# EAGLE design PicTouchTest (EAGLE 7.7.0)
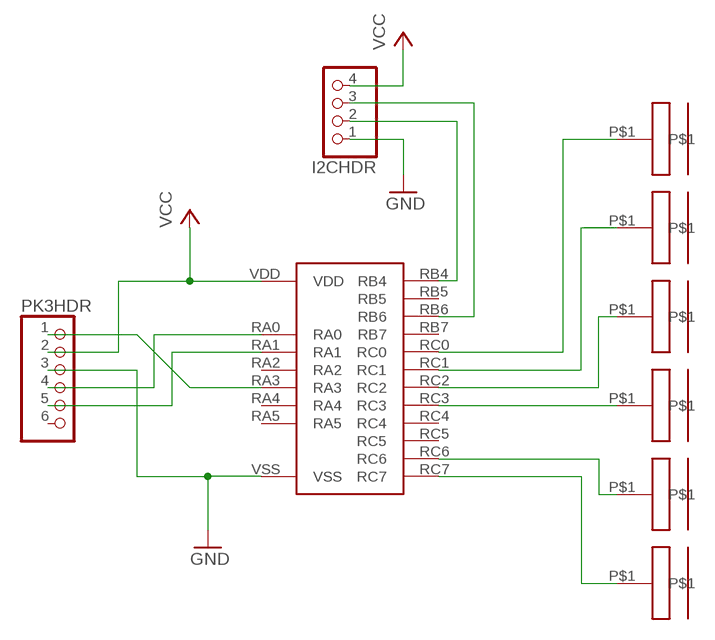
[diagram p0: schematic, sheet 1]

## Parts
I2CHDR  PINHD-1X4  [1X04]
PK3HDR  PINHD-1X6  [1X06]
U$1  PIC16F1707  [PIC16F1707]
U$2  CAPTOUCH20MMRND  [20MMROUND]
U$3  CAPTOUCH20MMRND  [20MMROUND]
U$4  CAPTOUCH20MMRND  [20MMROUND]
U$5  CAPTOUCH20MMRND  [20MMROUND]
U$6  CAPTOUCH20MMRND  [20MMROUND]
U$7  CAPTOUCH20MMRND  [20MMROUND]

## Nets
GND: I2CHDR.1 PK3HDR.3 U$1.VSS
N$1: PK3HDR.4 U$1.RA0
N$2: PK3HDR.5 U$1.RA1
N$3: PK3HDR.1 U$1.RA3
N$6: U$1.RC0 U$2.P$1
N$7: U$1.RC1 U$3.P$1
N$8: U$1.RC2 U$4.P$1
N$9: U$1.RC3 U$5.P$1
N$10: U$1.RC6 U$6.P$1
N$11: U$1.RC7 U$7.P$1
N$12: I2CHDR.2 U$1.RB4
N$13: I2CHDR.3 U$1.RB6
VCC: I2CHDR.4 PK3HDR.2 U$1.VDD
Unconnected: PK3HDR.6 U$1.RA2 U$1.RA4 U$1.RA5 U$1.RB5 U$1.RB7 U$1.RC4 U$1.RC5

## Library data of the parts
I2CHDR = pinhead:PINHD-1X4: PIN HEADER
PK3HDR = pinhead:PINHD-1X6: PIN HEADER
U$1 = PICMicros:PIC16F1707
U$2-U$7 = CapTouch:CAPTOUCH

## Board
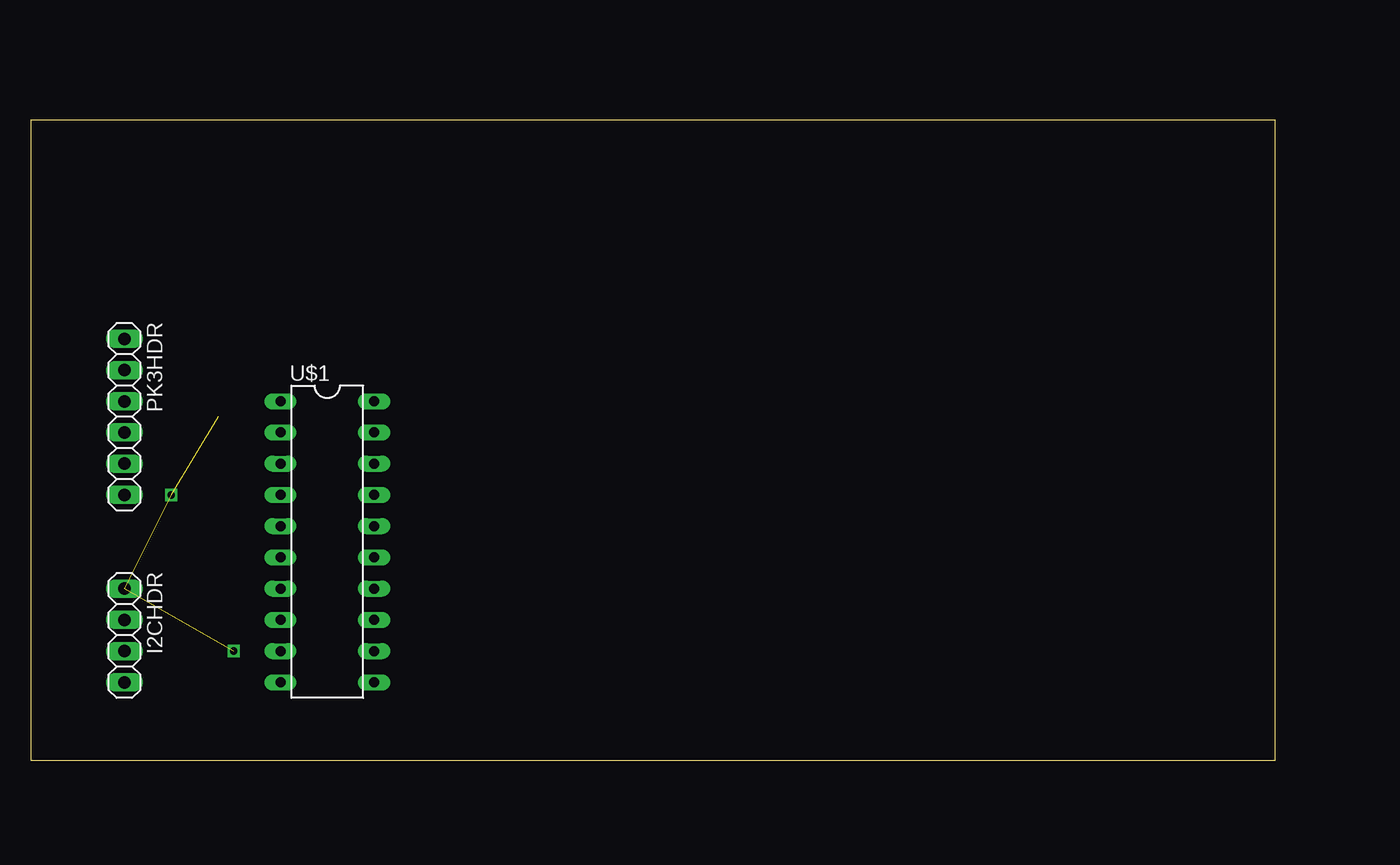
[diagram p1: board, top side]
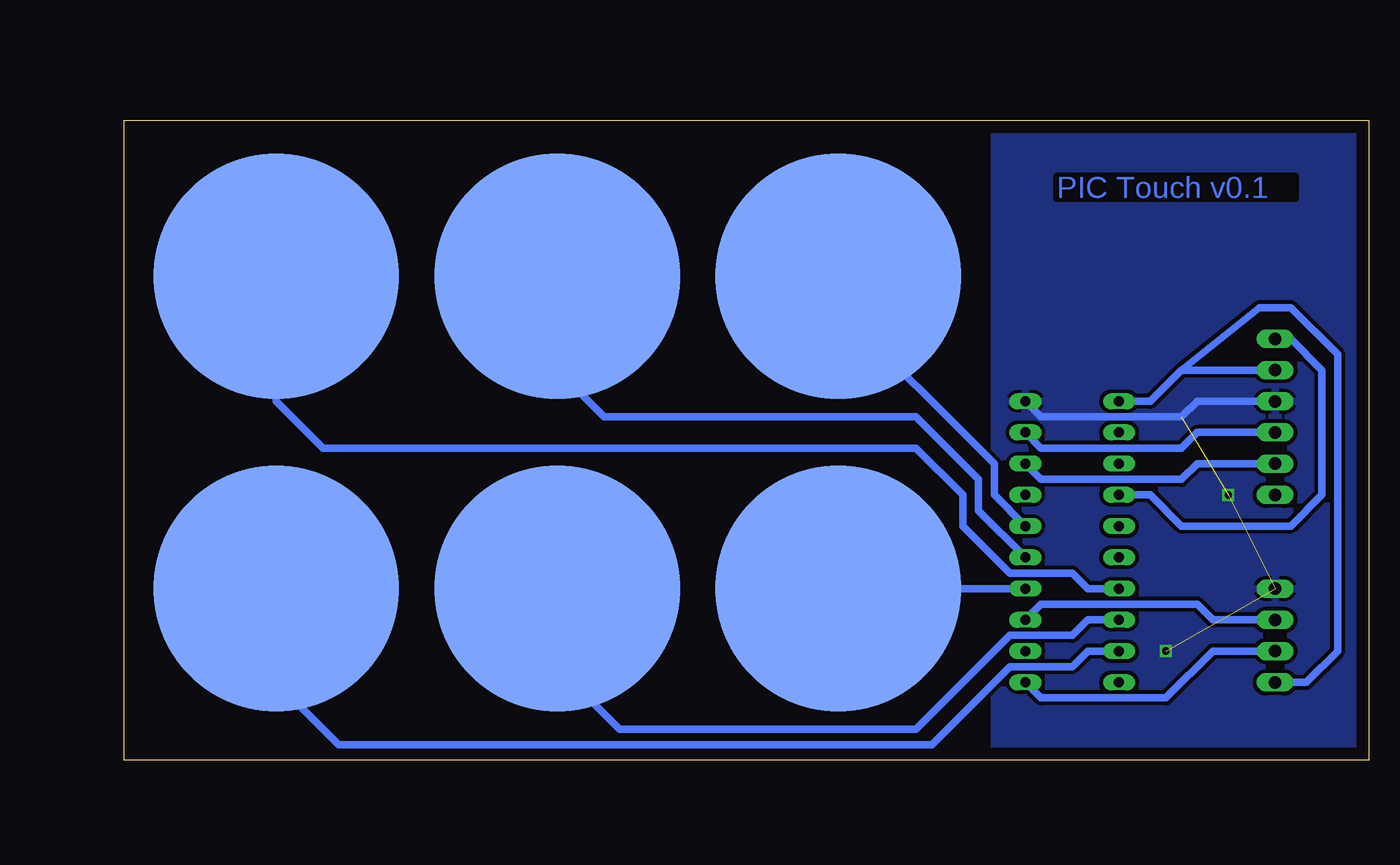
[diagram p2: board, bottom side, seen from below]

Size 101.27 x 52.06 mm. Coordinates in mm from the lower left corner, seen from the top.
Outline: 0,0 101.27,0 101.27,52.06 0,52.06 0,0
Copper layers (1*16): Top 0.035mm / dielectric 1.5mm / Bottom 0.035mm
Design rules "default": minimum track width 10mil, minimum drill 24mil, track to track 8mil, track to pad 8mil, pad to pad 8mil, via to via 8mil, smd to smd 8mil, copper to edge 40mil, drill to drill 8mil, minimum pad ring 10mil, minimum via ring 8mil, stop-mask expansion 4mil, vias tented up to drill 0mil, thermal gap 10mil

### Footprints (pad centres in the part's own frame; a part is rotated, then mirrored left to right if it is on the bottom)
1X04 = drill 1.016 long: 1 -3.81,0; 2 -1.27,0; 3 1.27,0; 4 3.81,0
1X06 = drill 1.016 long: 1 -6.35,0; 2 -3.81,0; 3 -1.27,0; 4 1.27,0; 5 3.81,0; 6 6.35,0
PIC16F1707 = drill 0.813 long: RA0 -8.89,3.81; RA1 -6.35,3.81; RA2 -3.81,3.81; RA3 -3.81,-3.81; RA4 -6.35,-3.81; RA5 -8.89,-3.81; RB4 6.35,3.81; RB5 8.89,3.81; RB6 11.43,3.81; RB7 11.43,-3.81; RC0 -1.27,3.81; RC1 1.27,3.81; RC2 3.81,3.81; RC3 3.81,-3.81; RC4 1.27,-3.81; RC5 -1.27,-3.81; RC6 6.35,-3.81; RC7 8.89,-3.81; VDD -11.43,-3.81; VSS -11.43,3.81
20MMROUND = smd 19.99 x 19.99: P$1 0,0

### Placement (x,y rotation side)
I2CHDR  7.62,10.16 270 top
PK3HDR  7.62,27.94 270 top
U$1  24.13,17.78 270 top
U$2  43.18,39.37 0 bottom
U$3  66.04,39.37 0 bottom
U$4  43.18,13.97 0 bottom
U$5  88.9,39.37 0 bottom
U$6  66.04,13.97 0 bottom
U$7  88.9,13.97 0 bottom

### Tracks (layer width: path | path; a pad name or v marks a point on that pad's centre or on a via)
GND  (via drill 0.6)  (3 unrouted)
  Bottom 0.61: PK3HDR.3 13.97,29.21 15.24,27.94 26.67,27.94 U$1.VSS
  other vias: 11.43,21.59 16.51,8.89
  pour Bottom (isolate 0.305): 0,0 30.48,0 30.48,52.07 0,52.07
N$1
  Bottom 0.61: PK3HDR.4 13.97,26.67 15.24,25.4 26.67,25.4 U$1.RA0
N$2
  Bottom 0.61: PK3HDR.5 13.97,24.13 15.24,22.86 26.67,22.86 U$1.RA1
N$3
  Bottom 0.61: PK3HDR.1 6.35,34.29 3.81,31.75 3.81,21.59 6.35,19.05 15.24,19.05 17.78,21.59 U$1.RA3
N$6
  Bottom 0.61: U$1.RC0 30.48,21.59 30.48,24.13 43.18,36.83 U$2.P$1
N$7
  Bottom 0.61: U$1.RC1 31.75,20.32 31.75,22.86 36.83,27.94 62.23,27.94 66.04,31.75 U$3.P$1
N$8
  Bottom 0.61: U$1.RC2 U$4.P$1
N$9
  Bottom 0.61: U$1.RC3 22.86,13.97 24.13,15.24 29.21,15.24 33.02,19.05 33.02,21.59 36.83,25.4 85.09,25.4 88.9,29.21 U$5.P$1
N$10
  Bottom 0.61: U$1.RC6 22.86,11.43 24.13,10.16 29.21,10.16 36.83,2.54 60.96,2.54 66.04,7.62 U$6.P$1
N$11
  Bottom 0.61: U$1.RC7 22.86,8.89 24.13,7.62 29.21,7.62 35.56,1.27 83.82,1.27 88.9,6.35 U$7.P$1
N$12
  Bottom 0.61: I2CHDR.2 12.7,11.43 13.97,12.7 26.67,12.7 U$1.RB4
N$13
  Bottom 0.61: I2CHDR.3 12.7,8.89 16.51,5.08 26.67,5.08 U$1.RB6
VCC
  Bottom 0.61: PK3HDR.2 15.24,31.75 | 15.24,31.75 17.78,29.21 U$1.VDD | I2CHDR.4 5.08,6.35 2.54,8.89 2.54,33.02 6.35,36.83 8.89,36.83 15.24,31.75

### Text on the board
Bottom: PIC Touch v0.1